# EAGLE design 2-channels-audio-amp (EAGLE 6.3)
2 Channels LM386 Audio Amplifier By: Abdallah Ali Abdallah Date: 9-2014 Licence: CC-BY-V.4
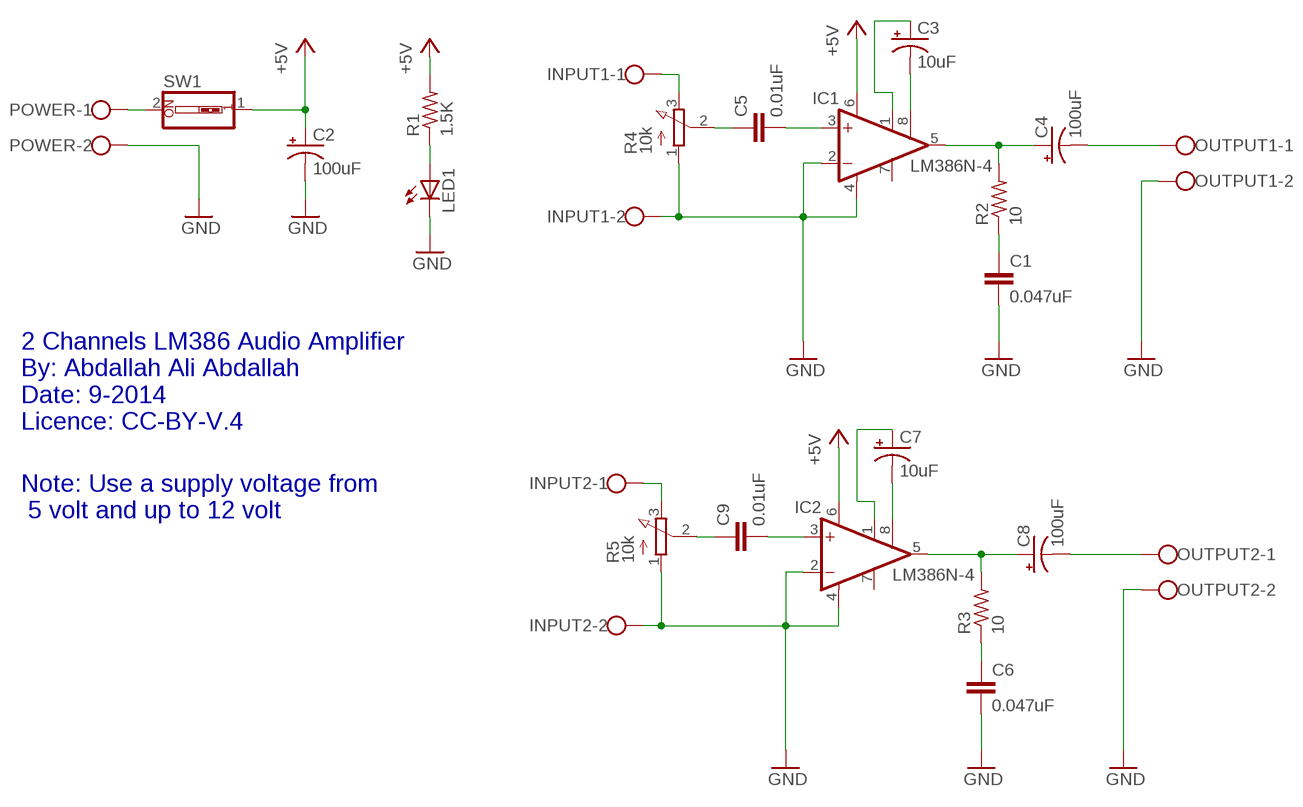
[diagram p0: schematic, sheet 1]

## Parts
C1  0.047uF  C-EU025-025X050  [C025-025X050]
C2  100uF  CPOL-USE2.5-6  [E2,5-6]
C3  10uF  CPOL-USE2.5-6  [E2,5-6]
C4  100uF  CPOL-USE2.5-6  [E2,5-6]
C5  0.01uF  C-EU025-025X050  [C025-025X050]
C6  0.047uF  C-EU025-025X050  [C025-025X050]
C7  10uF  CPOL-USE2.5-6  [E2,5-6]
C8  100uF  CPOL-USE2.5-6  [E2,5-6]
C9  0.01uF  C-EU025-025X050  [C025-025X050]
IC1  LM386N-4  [DIL08]
IC2  LM386N-4  [DIL08]
INPUT1  W237-102  [W237-102]
INPUT2  W237-102  [W237-102]
LED1  LED5MM  [LED5MM]
OUTPUT1  W237-102  [W237-102]
OUTPUT2  W237-102  [W237-102]
POWER  W237-102  [W237-102]
R1  1.5K  R-US_0204/7  [0204/7]
R2  10  R-US_0204/7  [0204/7]
R3  10  R-US_0204/7  [0204/7]
R4  10k  3RP/1610N  [3RP/1610N]
R5  10k  3RP/1610N  [3RP/1610N]
SW1  SW_DIP-1  [EDG-01]

## Nets
+5V: C2.+ IC1.6(VS) IC2.6(VS) R1.2 SW1.1
GND: C1.2 C2.- C6.2 IC1.2(-IN) IC1.4(GND) IC2.2(-IN) IC2.4(GND) INPUT1.2 INPUT2.2 LED1.K(C) OUTPUT1.2 OUTPUT2.2 POWER.2 R4.1(A) R5.1(A)
N$1: C4.+ IC1.5(OUT) R2.2
N$2: C3.- IC1.8(GAIN)
N$3: C3.+ IC1.1(GAIN)
N$4: C4.- OUTPUT1.1
N$5: C1.1 R2.1
N$6: INPUT1.1 R4.3(E)
N$7: LED1.A R1.1
N$8: C5.2 IC1.3(+IN)
N$9: C7.- IC2.8(GAIN)
N$10: C7.+ IC2.1(GAIN)
N$11: POWER.1 SW1.2
N$12: C8.+ IC2.5(OUT) R3.2
N$13: C8.- OUTPUT2.1
N$14: C6.1 R3.1
N$15: C9.2 IC2.3(+IN)
N$16: INPUT2.1 R5.3(E)
N$17: C5.1 R4.2(S)
N$18: C9.1 R5.2(S)
Unconnected: IC1.7(BYPASS) IC2.7(BYPASS)

## Notes on the sheet
- 2 Channels LM386 Audio Amplifier
  By: Abdallah Ali Abdallah
  Date: 9-2014
  Licence: CC-BY-V.4
- Note: Use a supply voltage from
   5 volt and up to 12 volt

## Library data of the parts
C1 C5 C6 C9 = rcl:C-EU: CAPACITOR, European symbol
C2-C4 C7 C8 = rcl:CPOL-US: POLARIZED CAPACITOR, American symbol
IC1 IC2 = linear:LM386?-*: Low Voltage Audio Power Amplifier Source: http://cache.national.com/ds/LM/LM386.pdf
INPUT1 INPUT2 OUTPUT1 OUTPUT2 POWER = con-wago-500:W237-102: WAGO SCREW CLAMP; MPN: 237-102; OC_FARNELL: unknown; OC_NEWARK: 70K9898
LED1 = led:LED: LED OSRAM: - CHIPLED LG R971, LG N971, LY N971, LG Q971, LY Q971, LO R971, LY R971 LH N974, LH R974 LS Q976, LO Q976, LY Q976 LO Q996 - Hyper CHIPLED LW Q18S LB Q993, LB Q99A, LB R99A - SideLED LS A670, LO A670, LY A670, LG A670, LP A670 LB A673, LV A673, LT A673, LW A673 LH A674 LY A675 LS A676, LA A676, LO A676, LY A676, LW A676 LS A679, LY A679, LG A679 - Hyper Micro SIDELED® LS Y876, LA Y876, LO Y876, LY Y876 LT Y87S - SmartLED LW L88C, LW L88S LB L89C, LB L89S, LG L890 LS L89K, LO L89K, LY L89K LS L896, LA L896, LO L896, LY L896 - TOPLED LS T670, LO T670, LY T670, LG T670, LP T670 LSG T670, LSP T670, LSY T670, LOP T670, LYG T670 LG T671, LOG T671, LSG T671 LB T673, LV T673, LT T673, LW T673 LH T674 LS T676, LA T676, LO T676, LY T676, LB T676, LH T676, LSB T676, LW T676 LB T67C, LV T67C, LT T67C, LS T67K, LO T67K, LY T67K, LW E67C LS E67B, LA E67B, LO E67B, LY E67B, LB E67C, LV E67C, LT E67C LW T67C LS T679, LY T679, LG T679 LS T770, LO T770, LY T770, LG T770, LP T770 LB T773, LV T773, LT T773, LW T773 LH T774 LS E675, LA E675, LY E675, LS T675 LS T776, LA T776, LO T776, LY T776, LB T776 LHGB T686 LT T68C, LB T68C - Hyper Mini TOPLED® LB M676 - Mini TOPLED Santana® LG M470 LS M47K, LO M47K, LY M47K Source: http://www.osram.convergy.de LUXEON: - LUMILED® LXK2-PW12-R00, LXK2-PW12-S00, LXK2-PW14-U00, LXK2-PW14-V00 LXK2-PM12-R00, LXK2-PM12-S00, LXK2-PM14-U00 LXK2-PE12-Q00, LXK2-PE12-R00, LXK2-PE12-S00, LXK2-PE14-T00, LXK2-PE14-U00 LXK2-PB12-K00, LXK2-PB12-L00, LXK2-PB12-M00, LXK2-PB14-N00, LXK2-PB14-P00, LXK2-PB14-Q00 LXK2-PR12-L00, LXK2-PR12-M00, LXK2-PR14-Q00, LXK2-PR14-R00 LXK2-PD12-Q00, LXK2-PD12-R00, LXK2-PD12-S00 LXK2-PH12-R00, LXK2-PH12-S00 LXK2-PL12-P00, LXK2-PL12-Q00, LXK2-PL12-R00 Source: www.luxeon.com KINGBRIGHT: KA-3528ASYC Source: www.kingbright.com
R1-R3 = rcl:R-US_: RESISTOR, American symbol
R4 R5 = pot:3RP/1610N: 16mm Potentiometer one level Source: http://www.alphapotentiometers.net/html/16mm_pot_2.html
SW1 = special:SW_DIP-1: DIP SWITCH

## Board
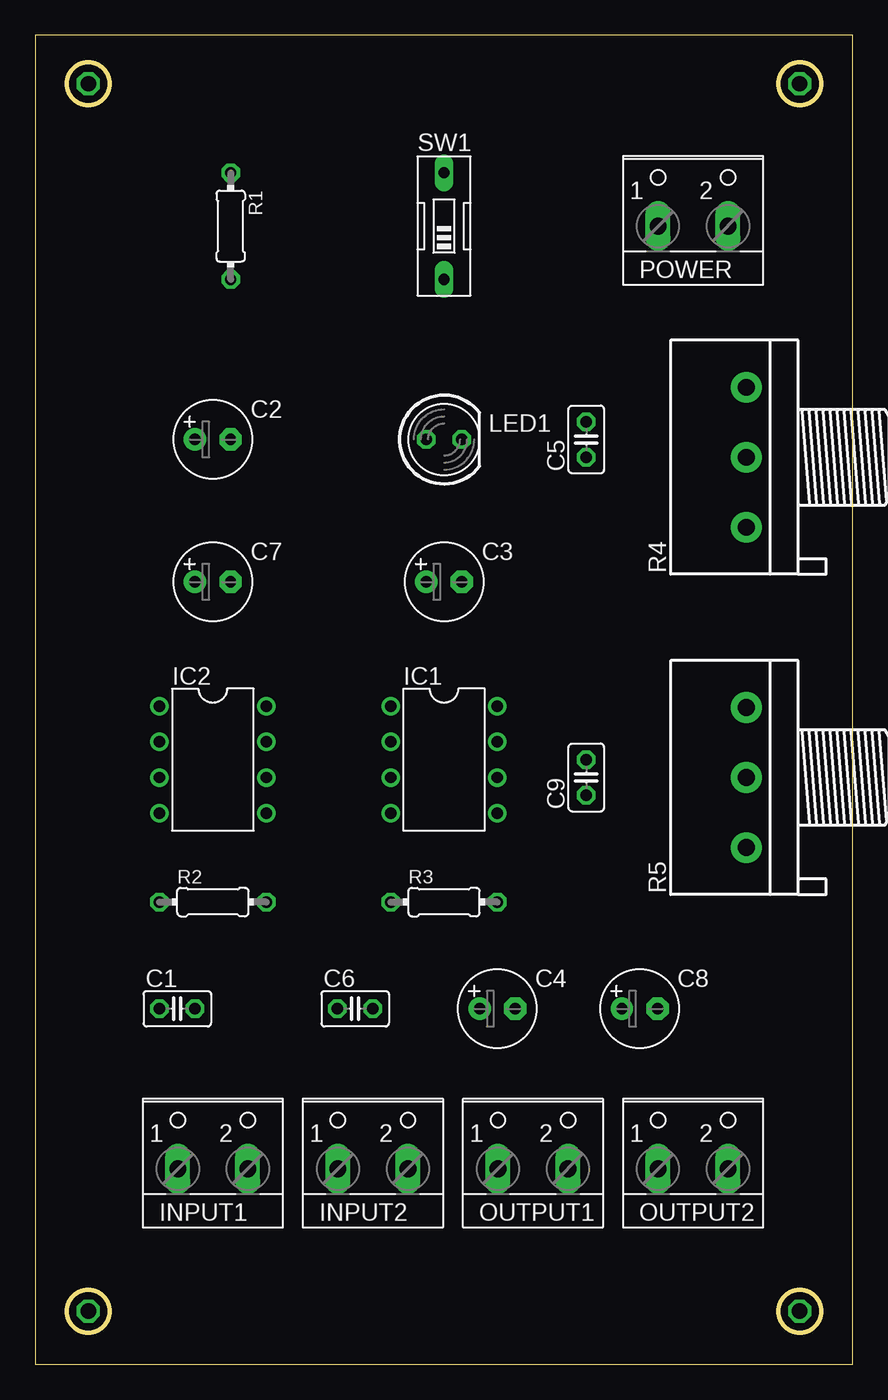
[diagram p1: board, top side]
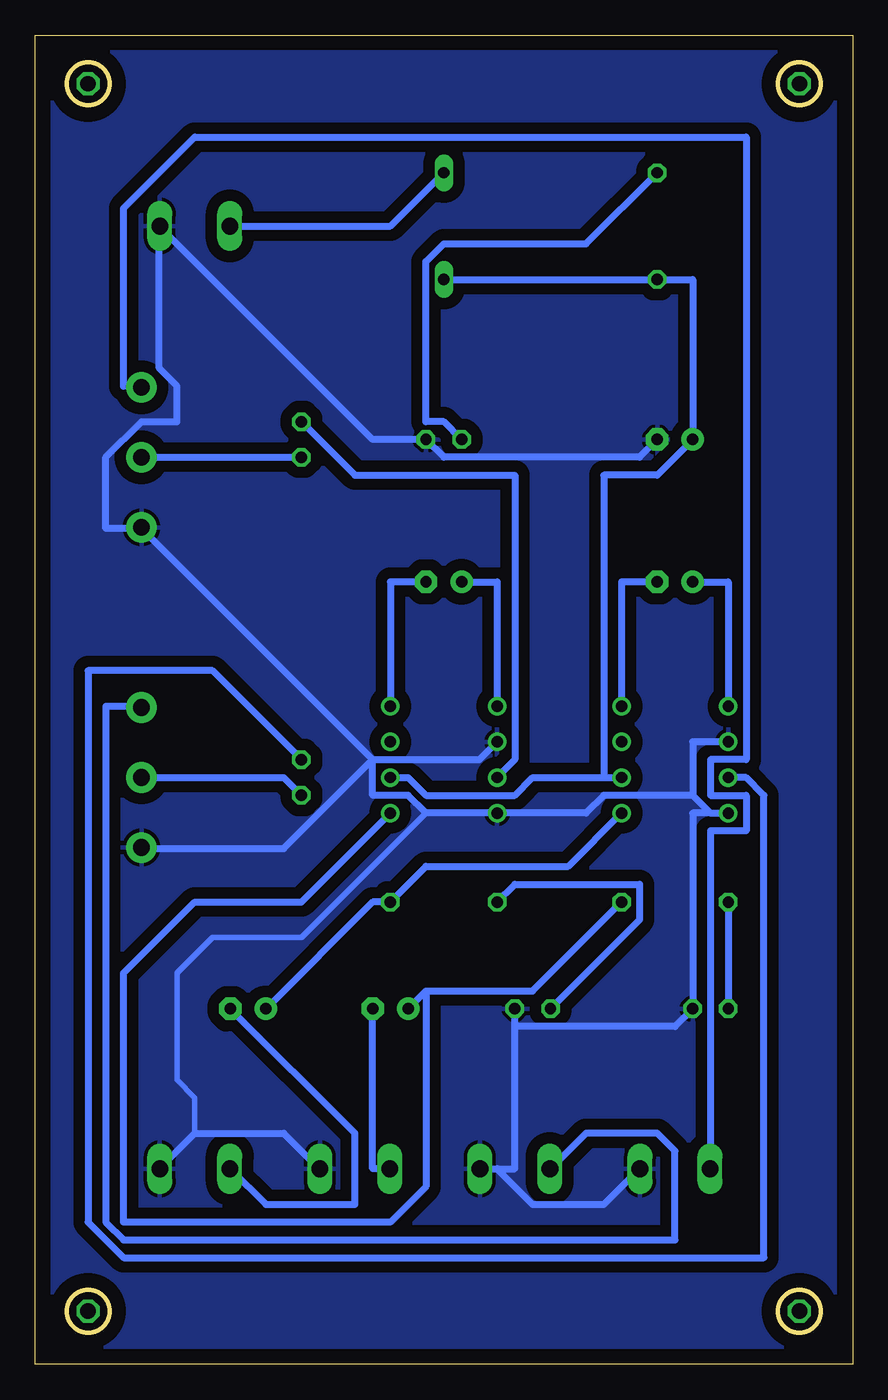
[diagram p2: board, bottom side, seen from below]

Size 58.4 x 94.92 mm. Coordinates in mm from the lower left corner, seen from the top.
Outline: 0,0 58.4,0 58.4,94.92 0,94.92 0,0
Outline: circle at 54.61,91.44 radius 1.52
Outline: circle at 3.81,91.44 radius 1.52
Outline: circle at 3.81,3.81 radius 1.52
Outline: circle at 54.61,3.81 radius 1.52
Copper layers (1*16): Top 0.035mm / dielectric 1.5mm / Bottom 0.035mm
Design rules "default *": minimum track width 19mil, minimum drill 24mil, track to track 10mil, track to pad 10mil, pad to pad 8mil, via to via 8mil, smd to smd 8mil, copper to edge 40mil, drill to drill 8mil, minimum pad ring 10mil, minimum via ring 8mil, stop-mask expansion 4mil, vias tented up to drill 0mil, thermal gap 10mil

### Footprints (pad centres in the part's own frame; a part is rotated, then mirrored left to right if it is on the bottom)
C025-025X050 = drill 0.813 octagon: 1 -1.27,0; 2 1.27,0
E2,5-6 = drill 0.813 pad 1.6: + -1.27,0 | drill 0.813 pad 1.6 octagon: - 1.27,0
DIL08 = drill 0.813 pad 1.27: 1 -3.81,-3.81; 2 -1.27,-3.81; 3 1.27,-3.81; 4 3.81,-3.81; 5 3.81,3.81; 6 1.27,3.81; 7 -1.27,3.81; 8 -3.81,3.81
W237-102 = drill 1.194 long: 1 -2.5,-1.27; 2 2.5,-1.27
LED5MM = drill 0.813 octagon: A -1.27,0; K 1.27,0
0204/7 = drill 0.813 octagon: 1 -3.81,0; 2 3.81,0
3RP/1610N = drill 1.2 pad 2.184: 1 -5,0; 2 0,0; 3 5,0
EDG-01 = drill 0.813 long: 1 0,-3.81; 2 0,3.81

### Placement (x,y rotation side)
C1  10.16,25.4 0 top
C2  12.7,66.04 0 top
C3  29.21,55.88 0 top
C4  33.02,25.4 0 top
C5  39.37,66.04 90 top
C6  22.86,25.4 0 top
C7  12.7,55.88 0 top
C8  43.18,25.4 0 top
C9  39.37,41.91 90 top
IC1  29.21,43.18 270 top
IC2  12.7,43.18 270 top
INPUT1  12.7,15.24 0 top
INPUT2  24.13,15.24 0 top
LED1  29.21,66.04 0 top
OUTPUT1  35.56,15.24 0 top
OUTPUT2  46.99,15.24 0 top
POWER  46.99,82.55 0 top
R1  13.97,81.28 270 top
R2  12.7,33.02 0 top
R3  29.21,33.02 0 top
R4  50.8,64.77 90 top
R5  50.8,41.91 90 top
SW1  29.21,81.28 0 top

### Tracks (layer width: path | path; a pad name or v marks a point on that pad's centre or on a via)
+5V
  Bottom 0.483: 17.78,41.91 22.86,41.91 24.13,40.64 30.48,40.64 31.75,41.91 IC1.6 | 17.78,41.91 IC2.6 | SW1.1 R1.2 11.43,77.47 C2.+ 13.97,63.5 17.78,63.5 17.78,41.91
GND
  Bottom 0.406: 46.99,16.51 46.99,19.05 48.26,20.32 48.26,27.94 45.72,30.48 39.37,30.48 30.48,39.37
  Bottom 0.483: C2.- 15.24,64.77 29.21,64.77 LED1.K 34.29,66.04 49.53,81.28 | IC1.2 26.67,43.18 34.29,43.18 | 34.29,43.18 40.64,36.83 50.8,36.83 R5.1 | 34.29,43.18 50.8,59.69 | 24.13,24.13 24.13,13.97 25.4,13.97 | 24.13,24.13 C6.2 | 25.4,13.97 INPUT2.2 26.67,13.97 | 25.4,13.97 22.86,11.43 17.78,11.43 15.24,13.97 INPUT1.2 | OUTPUT1.2 38.1,13.97 40.64,16.51 46.99,16.51 49.53,13.97 OUTPUT2.2 | 10.16,39.37 IC2.4 | 11.43,40.64 10.16,39.37 | 11.43,40.64 11.43,44.45 IC2.2 | 10.16,39.37 11.43,39.37 C1.2 12.7,24.13 24.13,24.13 | 11.43,40.64 17.78,40.64 19.05,39.37 IC1.4 30.48,39.37 31.75,40.64 34.29,40.64 34.29,43.18 | 49.53,81.28 49.53,71.12 48.26,69.85 48.26,67.31 50.8,67.31 53.34,64.77 53.34,59.69 50.8,59.69 | 49.53,81.28 POWER.2 | 50.8,59.69 R4.1
  pour Bottom (isolate 0.813): 1.27,1.27 57.15,1.27 57.15,93.98 1.27,93.98
N$1
  Bottom 0.483: R2.2 22.86,26.67 30.48,26.67 | C4.+ 30.48,26.67 | IC1.5 39.37,33.02 46.99,33.02 52.07,27.94 52.07,10.16 33.02,10.16 30.48,12.7 30.48,26.67
N$2
  Bottom 0.483: IC1.8 33.02,55.88 C3.-
N$3
  Bottom 0.483: IC1.1 25.4,55.88 C3.+
N$4
  Bottom 0.483: C4.- 34.29,13.97 OUTPUT1.1 33.02,13.97
N$5
  Bottom 0.483: R2.1 C1.1
N$6
  Bottom 0.483: INPUT1.1 10.16,13.97 10.16,38.1 7.62,38.1 7.62,40.64 10.16,40.64 10.16,43.18 7.62,43.18 7.62,87.63 46.99,87.63 52.07,82.55 52.07,69.85 50.8,69.85 R4.3
N$7
  Bottom 0.483: R1.1 19.05,80.01 29.21,80.01 30.48,78.74 30.48,67.31 29.21,67.31 LED1.A
N$8
  Bottom 0.483: IC1.3 24.13,43.18 24.13,63.5 35.56,63.5 C5.2
N$9
  Bottom 0.483: IC2.8 16.51,55.88 C7.-
N$10
  Bottom 0.483: IC2.1 8.89,55.88 C7.+
N$11
  Bottom 0.483: SW1.2 33.02,81.28 POWER.1
N$12
  Bottom 0.483: IC2.5 20.32,35.56 30.48,35.56 R3.2 34.29,33.02 C8.+
N$13
  Bottom 0.483: C8.- 35.56,16.51 35.56,11.43 41.91,11.43 44.45,13.97 OUTPUT2.1
N$14
  Bottom 0.483: C6.1 15.24,31.75 15.24,34.29 24.13,34.29 R3.1
N$15
  Bottom 0.483: IC2.3 7.62,41.91 6.35,40.64 6.35,7.62 52.07,7.62 54.61,10.16 54.61,49.53 45.72,49.53 C9.2
N$16
  Bottom 0.483: INPUT2.1 21.59,13.97 19.05,16.51 13.97,16.51 12.7,15.24 12.7,8.89 52.07,8.89 53.34,10.16 53.34,46.99 50.8,46.99 R5.3
N$17
  Bottom 0.483: R4.2 C5.1
N$18
  Bottom 0.483: C9.1 40.64,41.91 R5.2
N$19  (via drill 1.1)
  other vias: 54.61,91.44
N$20  (via drill 1.1)
  other vias: 3.81,91.44
N$21  (via drill 1.1)
  other vias: 3.81,3.81
N$22  (via drill 1.1)
  other vias: 54.61,3.81